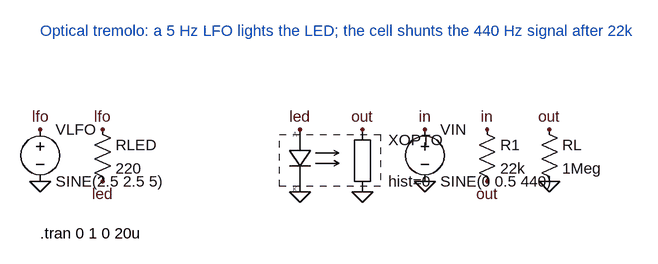
[diagram p0: schematic demo_vactrol.asc]
demo_vactrol.asc, the LTspice schematic file:
Version 4
SHEET 1 900 400
FLAG 0 112 lfo
FLAG 0 192 0
FLAG 96 112 lfo
FLAG 96 192 led
FLAG 400 112 led
FLAG 400 208 0
FLAG 496 112 out
FLAG 496 208 0
FLAG 592 112 in
FLAG 592 192 0
FLAG 688 112 in
FLAG 688 192 out
FLAG 784 112 out
FLAG 784 192 0
SYMBOL voltage 0 96 R0
SYMATTR InstName VLFO
SYMATTR Value SINE(2.5 2.5 5)
SYMBOL res 80 96 R0
SYMATTR InstName RLED
SYMATTR Value 220
SYMBOL VTL5C3 400 96 R0
SYMATTR InstName XOPTO
SYMBOL voltage 592 96 R0
SYMATTR InstName VIN
SYMATTR Value SINE(0 0.5 440)
SYMBOL res 672 96 R0
SYMATTR InstName R1
SYMATTR Value 22k
SYMBOL res 768 96 R0
SYMATTR InstName RL
SYMATTR Value 1Meg
TEXT 0 272 Left 2 !.tran 0 1 0 20u
TEXT 0 -40 Left 2 ;Optical tremolo: a 5 Hz LFO lights the LED; the cell shunts the 440 Hz signal after 22k

The netlist it stands for:
* demo_vactrol.asc
VLFO lfo 0 SINE(2.5 2.5 5)
RLED lfo led 220
XXOPTO led 0 out 0 VTL5C3 hist=0  ; pins A K C1 C2
VIN in 0 SINE(0 0.5 440)
R1 in out 22k
RL out 0 1Meg
.tran 0 1 0 20u
* Optical tremolo: a 5 Hz LFO lights the LED; the cell shunts the 440 Hz signal after 22k
.lib vactrol.sub
.backanno
.end